# EAGLE schematic MinoControl (EAGLE 7.2.0)
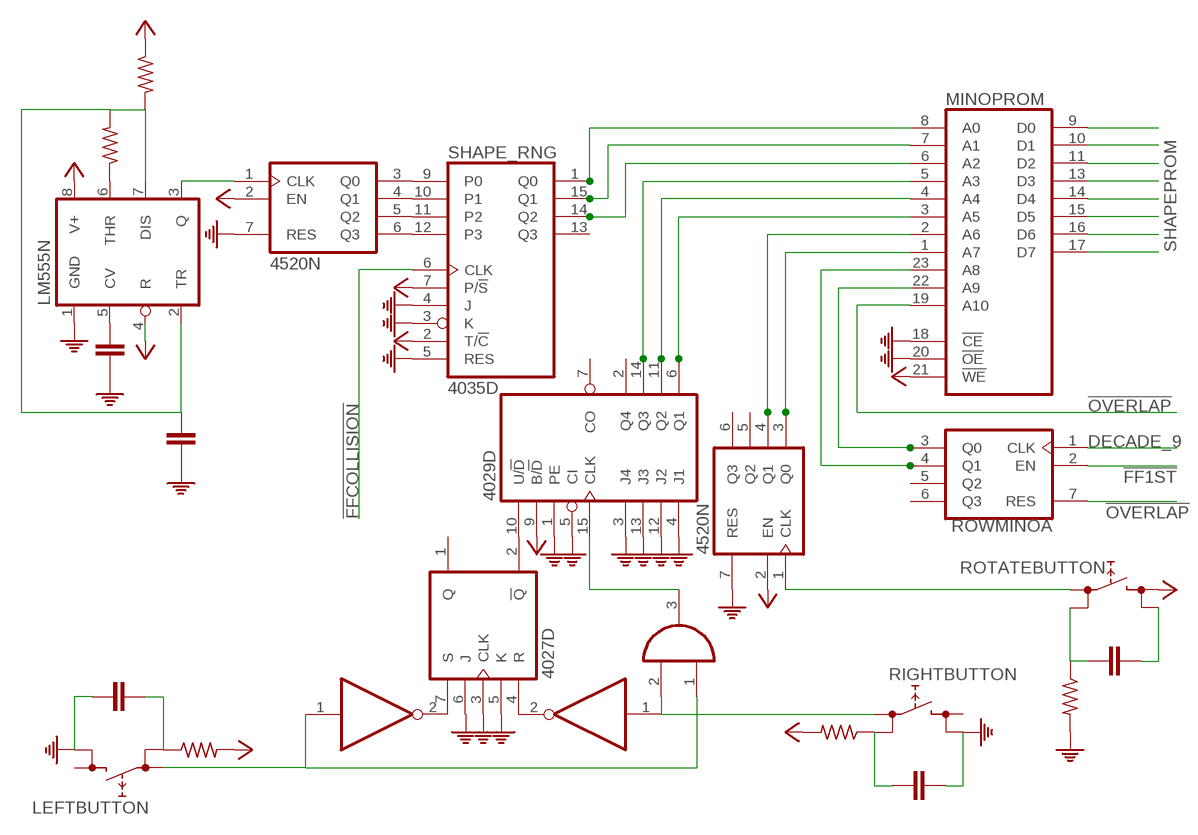
[diagram p0: schematic, sheet 1]

## Parts
IC1  LM555N  [DIL08]
IC2  4069D  [SO14]
IC3  4069D  [SO14]
IC4  4520N  [DIL16]
IC5  4027D  [SO16]
IC6  4029D  [SO16]
IC7  4081D  [SO14]
IC8  4520N  [DIL16]
LEFTBUTTON  REKN  [REKN]
MINOPROM  2816  [DIL24]
R1  R-US_0204/7  [0204/7]
R2  R-US_0204/7  [0204/7]
R3  R-US_0204/7  [0204/7]
R4  R-US_0204/7  [0204/7]
R5  R-US_0204/7  [0204/7]
RIGHTBUTTON  REKN  [REKN]
ROTATEBUTTON  REKN  [REKN]
ROWMINO  4520N  [DIL16]
SHAPE_RNG  4035D  [SO16]

## Nets
!FF1ST: ROWMINO.2(A:EN)
!FFCOLLISION: SHAPE_RNG.6(CLK)
!OVERLAP: MINOPROM.19(A10) ROWMINO.7(A:RES)
DECADE_9: ROWMINO.1(A:CLK)
N$1: LEFTBUTTON.0B R1.1
N$2: R2.1 ROTATEBUTTON.0B
N$3: R3.1 RIGHTBUTTON.0B
N$4: IC1.6(THR) R5.1
N$5: IC4.3(A:Q0) MINOPROM.1(A7)
N$6: IC2.1(A:I) IC7.1(A:I0) LEFTBUTTON.0A
N$7: IC3.1(A:I) IC7.2(A:I1) RIGHTBUTTON.0A
N$8: IC4.1(A:CLK) ROTATEBUTTON.0A
N$9: IC3.2(A:O) IC5.4(A:R)
N$10: IC2.2(A:O) IC5.7(A:S)
N$11: IC5.2(A:!Q) IC6.10(U/!D)
N$12: IC6.15(CLK) IC7.3(A:O)
N$13: IC4.4(A:Q1) MINOPROM.2(A6)
N$14: IC6.14(Q3) MINOPROM.5(A3)
N$15: IC6.11(Q2) MINOPROM.4(A4)
N$16: IC6.6(Q1) MINOPROM.3(A5)
N$17: IC1.3(Q) IC8.1(A:CLK)
N$18: IC1.2(TR) IC1.7(DIS) R4.2 R5.2
N$19: ROTATEBUTTON.1B
N$20: IC8.3(A:Q0) SHAPE_RNG.9(P0)
N$21: IC8.4(A:Q1) SHAPE_RNG.10(P1)
N$22: IC8.5(A:Q2) SHAPE_RNG.11(P2)
N$23: IC8.6(A:Q3) SHAPE_RNG.12(P3)
N$24: MINOPROM.22(A9) ROWMINO.3(A:Q0)
N$25: MINOPROM.8(A0) SHAPE_RNG.1(Q0)
N$26: MINOPROM.7(A1) SHAPE_RNG.15(Q1)
N$27: MINOPROM.6(A2) SHAPE_RNG.14(Q2)
N$28: MINOPROM.23(A8) ROWMINO.4(A:Q1)
N$29: MINOPROM.14(D4)
N$30: MINOPROM.9(D0)
N$31: MINOPROM.11(D2)
N$32: MINOPROM.16(D6)
N$33: MINOPROM.17(D7)
N$34: MINOPROM.15(D5)
N$35: MINOPROM.13(D3)
PE: IC1.1(GND) IC4.7(A:RES) IC5.3(A:CLK) IC5.5(A:K) IC5.6(A:J) IC6.1(PE) IC6.3(J4) IC6.4(J1) IC6.5(CI) IC6.12(J2) IC6.13(J3) IC8.7(A:RES) LEFTBUTTON.1B MINOPROM.18(!CE) MINOPROM.20(!OE) R2.2 RIGHTBUTTON.1B SHAPE_RNG.3(K) SHAPE_RNG.4(J) SHAPE_RNG.5(RES)
SHAPEPROM: MINOPROM.10(D1)
V+: IC1.4(R) IC1.8(V+) IC4.2(A:EN) IC6.9(B/!D) IC8.2(A:EN) MINOPROM.21(!WE) R1.2 R3.2 R4.1 ROTATEBUTTON.1A SHAPE_RNG.2(T/!C) SHAPE_RNG.7(P/!S)
Unconnected: IC1.5(CV) IC2.3(B:I) IC2.4(B:O) IC2.5(C:I) IC2.6(C:O) IC2.8(D:O) IC2.9(D:I) IC2.10(E:O) IC2.11(E:I) IC2.12(F:O) IC2.13(F:I) IC3.3(B:I) IC3.4(B:O) IC3.5(C:I) IC3.6(C:O) IC3.8(D:O) IC3.9(D:I) IC3.10(E:O) IC3.11(E:I) IC3.12(F:O) IC3.13(F:I) IC4.5(A:Q2) IC4.6(A:Q3) IC4.9(B:CLK) IC4.10(B:EN) IC4.11(B:Q0) IC4.12(B:Q1) IC4.13(B:Q2) IC4.14(B:Q3) IC4.15(B:RES) IC5.1(A:Q) IC5.9(B:S) IC5.10(B:J) IC5.11(B:K) IC5.12(B:R) IC5.13(B:CLK) IC5.14(B:!Q) IC5.15(B:Q) IC6.2(Q4) IC6.7(CO) IC7.4(B:O) IC7.5(B:I0) IC7.6(B:I1) IC7.8(C:I0) IC7.9(C:I1) IC7.10(C:O) IC7.11(D:O) IC7.12(D:I0) IC7.13(D:I1) IC8.9(B:CLK) IC8.10(B:EN) IC8.11(B:Q0) IC8.12(B:Q1) IC8.13(B:Q2) IC8.14(B:Q3) IC8.15(B:RES) LEFTBUTTON.1A RIGHTBUTTON.1A ROWMINO.5(A:Q2) ROWMINO.6(A:Q3) ROWMINO.9(B:CLK) ROWMINO.10(B:EN) ROWMINO.11(B:Q0) ROWMINO.12(B:Q1) ROWMINO.13(B:Q2) ROWMINO.14(B:Q3) ROWMINO.15(B:RES) SHAPE_RNG.13(Q3)

## Power pins joined to a net without a drawn wire
GND: MINOPROM.12(GND)
VCC: MINOPROM.24(VCC)
VDD: IC2.14(P:VDD) IC3.14(P:VDD) IC4.16(P:VDD) IC5.16(P:VDD) IC6.16(VDD) IC7.14(P:VDD) IC8.16(P:VDD) ROWMINO.16(P:VDD) SHAPE_RNG.16(VDD)
VSS: IC2.7(P:VSS) IC3.7(P:VSS) IC4.8(P:VSS) IC5.8(P:VSS) IC6.8(VSS) IC7.7(P:VSS) IC8.8(P:VSS) ROWMINO.8(P:VSS) SHAPE_RNG.8(VSS)

## Library data of the parts
IC1 = linear:*555: TIMER
IC2 IC3 = 40xx:4069: Hex INVERTER
IC4 IC8 ROWMINO = 45xx:4520: Dual binary up COUNTER
IC5 = 40xx:4027: Dual JK FLIP FLOP
IC6 = 40xx:4029: Binary/decimal up/down COUNTER
IC7 = 40xx:4081: Quad 2-input AND
LEFTBUTTON RIGHTBUTTON ROTATEBUTTON = switch:REKN: PUSH SWITCH ITT-Cannon-Cannon
MINOPROM = memory:2816: MEMORY
R1-R5 = rcl:R-US_: RESISTOR, American symbol
SHAPE_RNG = 40xx:4035: 4-bit parallel in/out SHIFT REGISTER